# Altium schematic sheet Sheet1.SchDoc
size A4
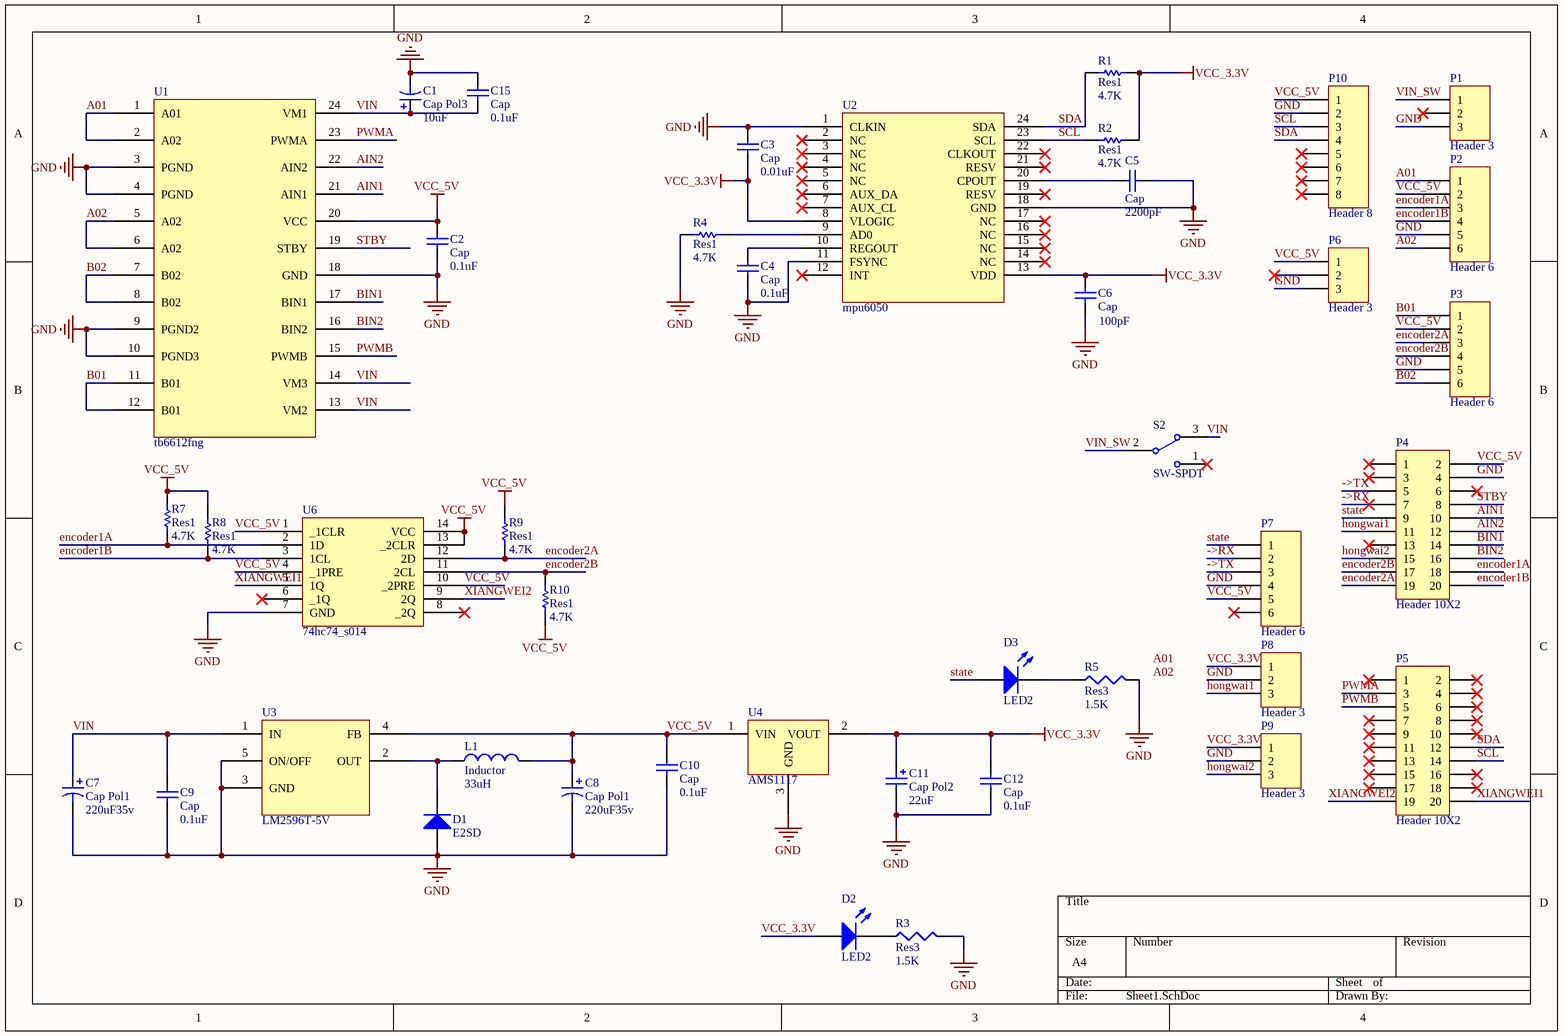
[diagram p0: Sheet1.SchDoc]

## Parts
C1  Cap Pol3  value 10uF  [CAP POL-SMD-B]
C2  Cap  value 0.1uF  [CAP-0805-手工焊接]
C3  Cap  value 0.01uF  [CAP-0805-手工焊接]
C4  Cap  value 0.1uF  [CAP-0805-手工焊接]
C5  Cap  value 2200pF  [CAP-0805-手工焊接]
C6  Cap  value 100pF  [CAP-0805-手工焊接]
C7  Cap Pol1  value 220uF35v  [C_SMD(8x10.3)]
C8  Cap Pol1  value 220uF35v  [C_SMD(8x10.3)]
C9  Cap  value 0.1uF  [CAP-0805-手工焊接]
C10  Cap  value 0.1uF  [CAP-0805-手工焊接]
C11  Cap Pol2  value 22uF  [CAP POL-SMD-B]
C12  Cap  value 0.1uF  [CAP-0805-手工焊接]
C15  Cap  value 0.1uF  [CAP-0805-手工焊接]
D1  E2SD  [SMA]
D2  LED2  [LED-0805-手工焊接]
D3  LED2  [LED-0805-手工焊接]
L1  Inductor  value 33uH  [CDRH127]
P1  Header 3  [HDR1X3]
P2  Header 6  [PH2.0 6P]
P3  Header 6  [PH2.0 6P]
P4  Header 10X2  [HDR2X10 - duplicate]
P5  Header 10X2  [HDR2X10 - duplicate]
P6  Header 3  [HDR1X3]
P7  Header 6  [HC05 MODULE]
P8  Header 3  [HDR1*3 no_edge]
P9  Header 3  [HDR1*3 no_edge]
P10  Header 8  [mpu6050 module]
R1  Res1  value 4.7K  [RES-0805_手工焊接]
R2  Res1  value 4.7K  [RES-0805_手工焊接]
R3  Res3  value 1.5K  [RES-0805_手工焊接]
R4  Res1  value 4.7K  [RES-0805_手工焊接]
R5  Res3  value 1.5K  [RES-0805_手工焊接]
R7  Res1  value 4.7K  [RES-0805_手工焊接]
R8  Res1  value 4.7K  [RES-0805_手工焊接]
R9  Res1  value 4.7K  [RES-0805_手工焊接]
R10  Res1  value 4.7K  [RES-0805_手工焊接]
S2  SW-SPDT  [ss12d10]
U1  tb6612fng  [tb6612fng - duplicate]
U2  mpu6050  [QFN-24]
U3  LM2596T-5V  [TO-263-5 - TYPE1]
U4  AMS1117  [SOT-223]
U6  74hc74_s014  [74HC74D_SOP14]

## Nets
GND: C1.2 C2.1 C3.2 C4.1 C5.1 C6.1 C7.2 C8.2 C9.1 C10.1 C11.2 C12.1 C15.2 D1.1(A) P1.3 P2.5 P3.5 P4.4 P6.3 P7.4 P8.2 P9.2 P10.2 R3.2 R4.1 R5.2 U1.3(PGND) U1.4(PGND) U1.9(PGND2) U1.10(PGND3) U1.18(GND) U2.1(CLKIN) U2.11(FSYNC) U2.18(GND) U3.3(GND) U3.5(ON/OFF) U4.3(GND) U6.7(GND)
VCC_3.3V: C3.1 C6.2 C11.1 C12.2 D2.1(A) P8.1 P9.1 R1.2 R2.2 U2.8(VLOGIC) U2.13(VDD) U4.2(VOUT)
VCC_5V: C2.2 C8.1 C10.2 L1.2 P2.2 P3.2 P4.2 P6.1 P7.5 P10.1 R7.1 R8.1 R9.1 R10.2 U1.20(VCC) U3.4(FB) U4.1(VIN) U6.1(_1CLR) U6.4(_1PRE) U6.10(_2PRE) U6.13(_2CLR) U6.14(VCC)
->RX: P4.7 P7.2
->TX: P4.5 P7.3
A01: P2.1 U1.1(A01) U1.2(A02)
A02: P2.6 U1.5(A02) U1.6(A02)
AIN1: P4.10 U1.21(AIN1)
AIN2: P4.12 U1.22(AIN2)
B01: P3.1 U1.11(B01) U1.12(B01)
B02: P3.6 U1.7(B02) U1.8(B02)
BIN1: P4.14 U1.17(BIN1)
BIN2: P4.16 U1.16(BIN2)
encoder1A: P2.3 P4.18 R7.2 U6.2(1D)
encoder1B: P2.4 P4.20 R8.2 U6.3(1CL)
encoder2A: P3.3 P4.19 R9.2 U6.12(2D)
encoder2B: P3.4 P4.17 R10.1 U6.11(2CL)
hongwai1: P4.11 P8.3
hongwai2: P4.15 P9.3
PWMA: P5.3 U1.23(PWMA)
PWMB: P5.5 U1.15(PWMB)
SCL: P5.14 P10.3 R2.1 U2.23(SCL)
SDA: P5.12 P10.4 R1.1 U2.24(SDA)
state: D3.1(A) P4.9 P7.1
STBY: P4.8 U1.19(STBY)
VIN: C1.1 C7.1 C9.2 C15.1 S2.3 U1.13(VM2) U1.14(VM3) U1.24(VM1) U3.1(IN)
VIN_SW: P1.1 S2.2
XIANGWEI1: P5.20 U6.5(1Q)
XIANGWEI2: P5.19 U6.9(2Q)
NetC4_2: C4.2 U2.10(REGOUT)
NetC5_2: C5.2 U2.20(CPOUT)
NetD1_2: D1.2(K) L1.1 U3.2(OUT)
NetD2_2: D2.2(K) R3.1
NetD3_2: D3.2(K) R5.1
NetR4_2: R4.2 U2.9(AD0)

Not connected (* = marked no-connect by the designer): P1 2*; P4 1* 3* 6* 13*; P5 1* 2* 4* 6* 7* 8* 9* 10* 11* 13* 15* 16* 17* 18*; P6 2*; P7 6*; P10 5* 6* 7* 8*; S2 1*; U2 2(NC)* 3(NC)* 4(NC)* 5(NC)* 6(AUX_DA)* 7(AUX_CL)* 12(INT)* 14(NC)* 15(NC)* 16(NC)* 17(NC)* 19(RESV)* 21(RESV)* 22(CLKOUT)*; U6 6(_1Q)* 8(_2Q)*

## Notes on the sheet
- Labels drawn without touching a wire or pin: A01, A02

## Library data of the parts
C1 = Cap Pol3: Polarized Capacitor (Surface Mount); Published: 8-Jun-2000; LatestRevisionDate: 29-May-2009; LatestRevisionNote: IPC-7351 Footprint Added.; PackageReference: C0805; Publisher: Altium Limited; PackageDescription: Chip Capacitor
C2-C6 C9 C10 C12 C15 = Cap: Capacitor; Published: 8-Jun-2000; LatestRevisionDate: 17-Jul-2002; LatestRevisionNote: Re-released for DXP Platform.; PackageReference: RAD-0.3; Publisher: Altium Limited; PackageDescription: Radial Cap, Thru-Hole; 2 Leads; 0.3 in Pin Spacing
C7 C8 = Cap Pol1: Polarized Capacitor (Radial); Published: 8-Jun-2000; LatestRevisionDate: 17-Jul-2002; LatestRevisionNote: Re-released for DXP Platform.; PackageReference: RB7.6-15; Publisher: Altium Limited; PackageDescription: Polarized Capacitor (Radial); 2 Leads
C11 = Cap Pol2: Polarized Capacitor (Axial); Published: 8-Jun-2000; LatestRevisionDate: 17-Jul-2002; LatestRevisionNote: Re-released for DXP Platform.; PackageReference: POLAR0.8; Publisher: Altium Limited; PackageDescription: Polarized Capacitor; 2 Leads
D1 = Diode: Default Diode; Published: 8-Jun-2000; LatestRevisionDate: 17-Jul-2002; LatestRevisionNote: Re-released for DXP Platform.; PackageVersion: Sep-1996; PackageReference: SMC; Publisher: Altium Limited; PackageDescription: DO-214-AB/SMC; 2 C-Bend Leads; Body 7.9 x 5.9 mm, inc. leads (LxW); Code_JEDEC: DO-214-AB
D2 D3 = LED2: Typical RED, GREEN, YELLOW, AMBER GaAs LED; Published: 8-Jun-2000; LatestRevisionDate: 17-Jul-2002; LatestRevisionNote: Re-released for DXP Platform.; PackageVersion: Feb-2002; PackageReference: 3.2X1.6X1.1; Publisher: Altium Limited; PackageDescription: SM LED; 2 Flat Leads
L1 = Inductor: Code_IEC: 1005; Published: 8-Jun-2000; LatestRevisionDate: 29-May-2009; LatestRevisionNote: IPC-7351 Footprint Added.; PackageReference: 0402-A; Publisher: Altium Limited; PackageDescription: Chip Inductor; Code_JEITA: 0402
P1 P6 P8 P9 = Header 3: Header, 3-Pin; LatestRevisionDate: 17-Jul-2002; LatestRevisionNote: Re-released for DXP Platform.; Publisher: Altium Limited
P2 P3 P7 = Header 6: Header, 6-Pin; LatestRevisionDate: 17-Jul-2002; LatestRevisionNote: Re-released for DXP Platform.; Publisher: Altium Limited
P4 P5 = Header 10X2: Header, 10-Pin, Dual row; LatestRevisionDate: 17-Jul-2002; LatestRevisionNote: Re-released for DXP Platform.; Publisher: Altium Limited
P10 = Header 8: Header, 8-Pin; LatestRevisionDate: 17-Jul-2002; LatestRevisionNote: Re-released for DXP Platform.; Publisher: Altium Limited
R1 R2 R4 R7-R10 = Res1: Resistor; Published: 8-Jun-2000; LatestRevisionDate: 17-Jul-2002; LatestRevisionNote: Re-released for DXP Platform.; PackageReference: AXIAL-0.3; Publisher: Altium Limited; PackageDescription: Axial Device, Thru-Hole; 2 Leads; 0.3 in Pin Spacing
R3 R5 = Res3: Resistor; Published: 8-Jun-2000; LatestRevisionDate: 29-May-2009; LatestRevisionNote: IPC-7351 Footprint Added.; PackageReference: J1-0603; Publisher: Altium Limited; PackageDescription: Chip Resistor
S2 = SW-SPDT: SPDT Subminiature Toggle Switch, Right Angle Mounting, Vertical Actuation; Published: 24-Mar-1999; LatestRevisionDate: 17-Dec-2003; LatestRevisionNote: Schematic revised, PCB Footprint replaced.; DatasheetVersion: 05-Dec-2000; PackageReference: TL36WW15050; Publisher: Altium Limited; PackageDescription: Switch; 4 Leads; ComponentLink1Description: Manufacturer Link; ComponentLink1URL: http://www.apem.com
U4 = AMS1117: pin to pad: 1>3 3>1